# EAGLE design dig_ac230 (EAGLE 6.2)

## Sheet 1 of 4
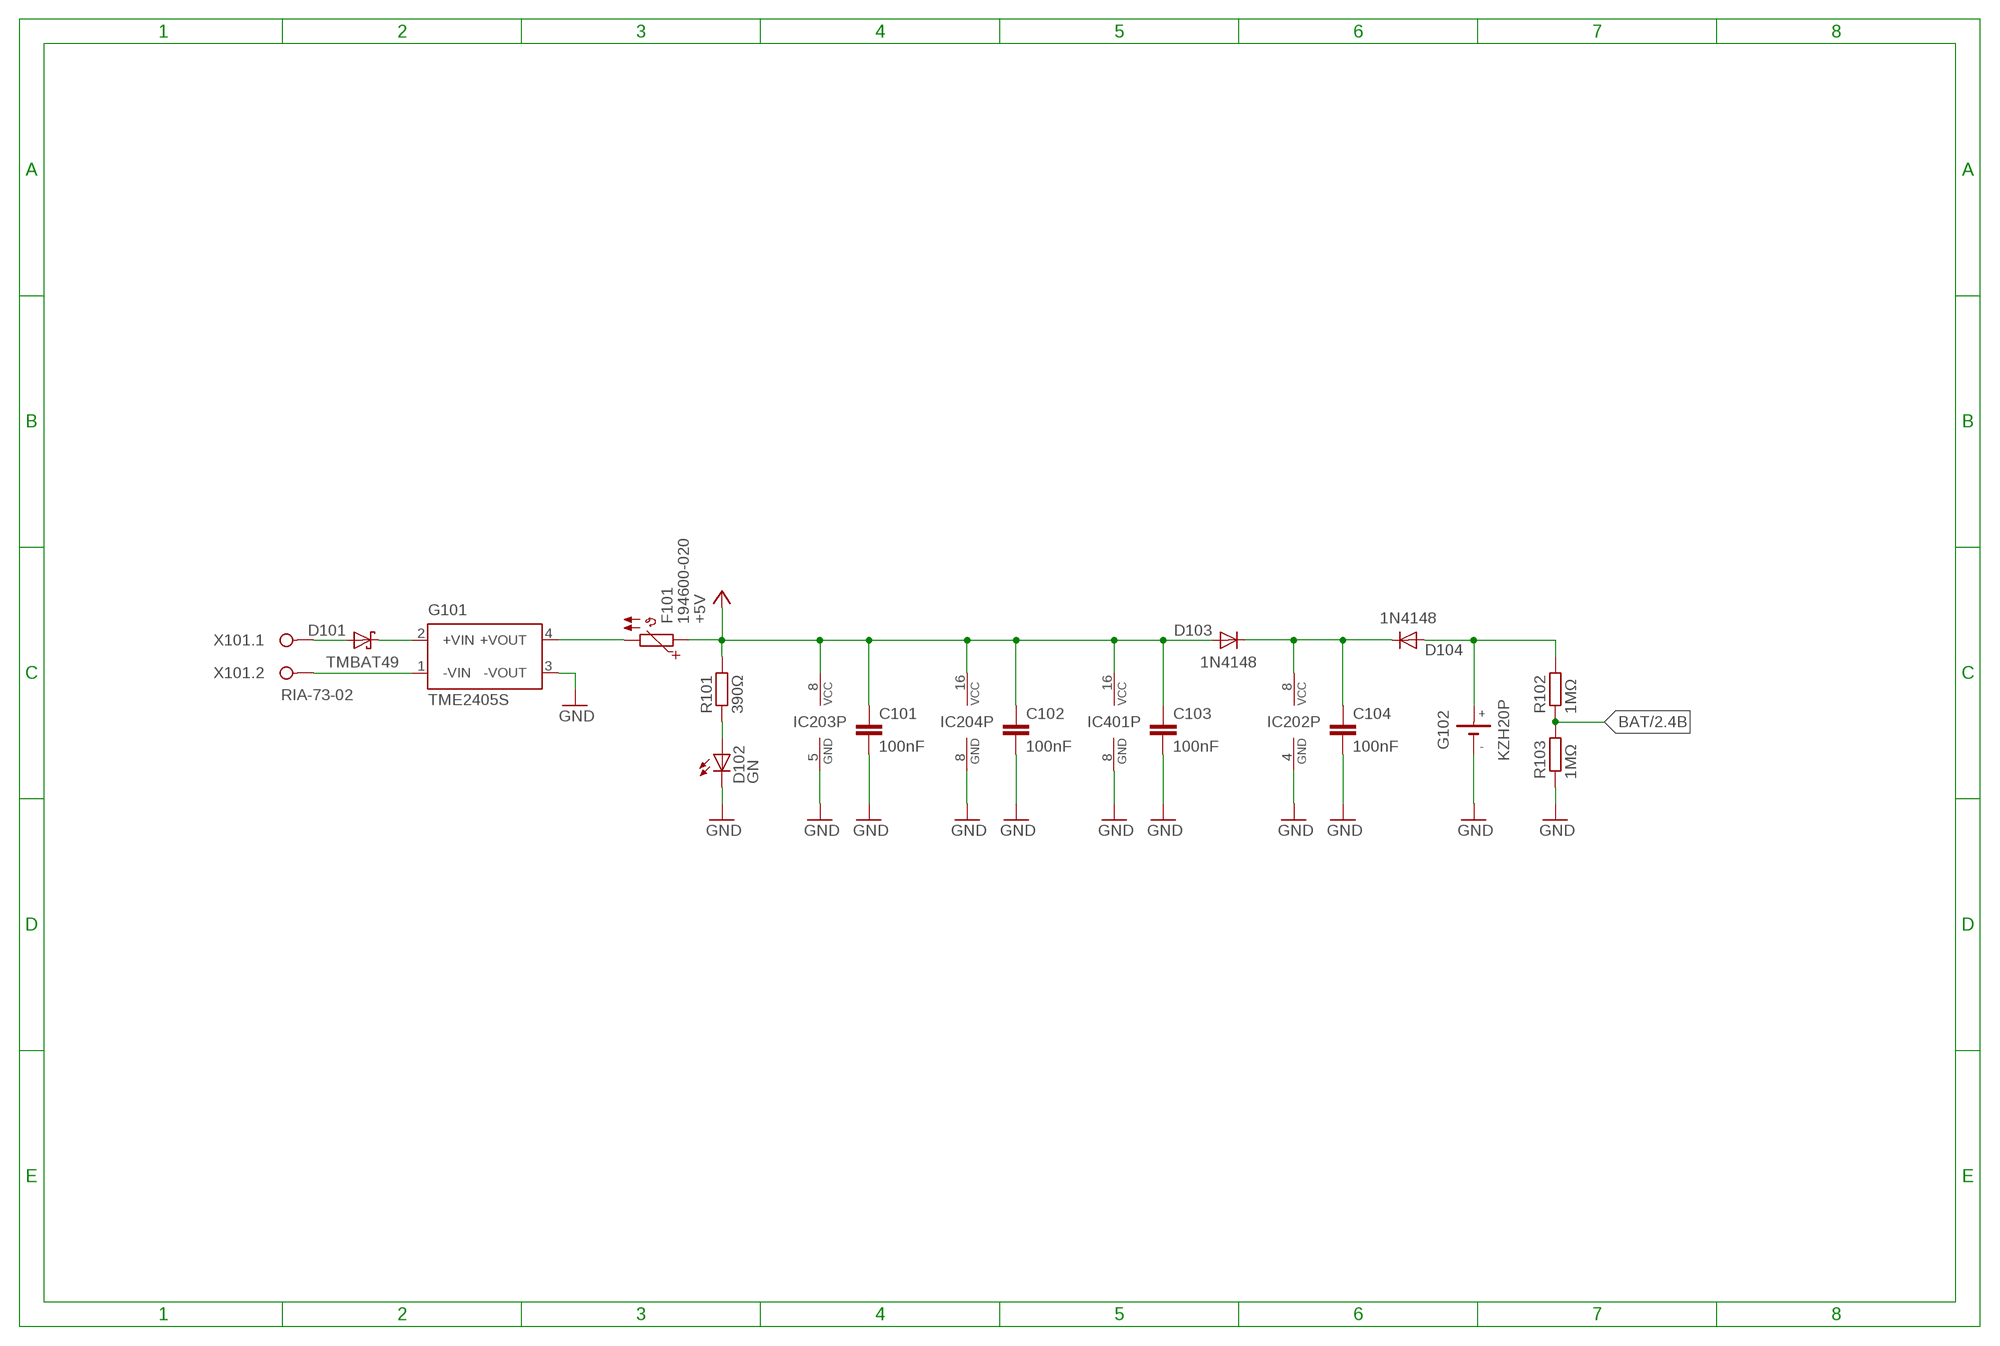
[diagram p0: schematic, sheet 1]

### Parts
C101  100nF  C_0805  [CHIP_0805]
C102  100nF  C_0805  [CHIP_0805]
C103  100nF  C_0805  [CHIP_0805]
C104  100nF  C_0805  [CHIP_0805]
D101  TMBAT49  SHOTKY-DIODE-MELF  [MELF]
D102  GN  LED3MM  [LED3MM]
D103  1N4148  DIODE-MINIMELF  [MINIMELF]
D104  1N4148  DIODE-MINIMELF  [MINIMELF]
F101  194600-020  [CHIP_1812]
G101  TME2405S  [TME-24V]
G102  KZH20P  [KZH20P]
IC202  DS1337S  [SOP08_127]
IC203  MAX487CSA  [SOP08_127]
IC204  74HC166D  [SOP16_127]
IC401  74HC595D  [SOP16_127]
R101  390Ω  R_0805  [CHIP_0805]
R102  1MΩ  R_0805  [CHIP_0805]
R103  1MΩ  R_0805  [CHIP_0805]
X101  RIA-73-02  [RIA-73-02]

### Nets
+5V: C101.1 C102.1 C103.1 D103.A F101.1 IC203.8(VCC) IC204.16(VCC) IC401.16(VCC) R101.2 ; also sheet 2,3
BAT: R102.1 R103.2 ; also sheet 2
GND: C101.2 C102.2 C103.2 C104.2 D102.K(C) G101.3(-VOUT) G102.N(-) IC202.4(GND) IC203.5(GND) IC204.8(GND) IC401.8(GND) R103.1 ; also sheet 2,3,4
N$19: G101.1(-VIN) X101.2
N$21: D104.A G102.P1(+) G102.P2(+) R102.2
N$23: D101.K G101.2(+VIN)
N$24: D101.A X101.1
N$41: F101.2 G101.4(+VOUT)
N$44: D102.A R101.1
N$64: C104.1 D103.K D104.K IC202.8(VCC)

## Sheet 2 of 4
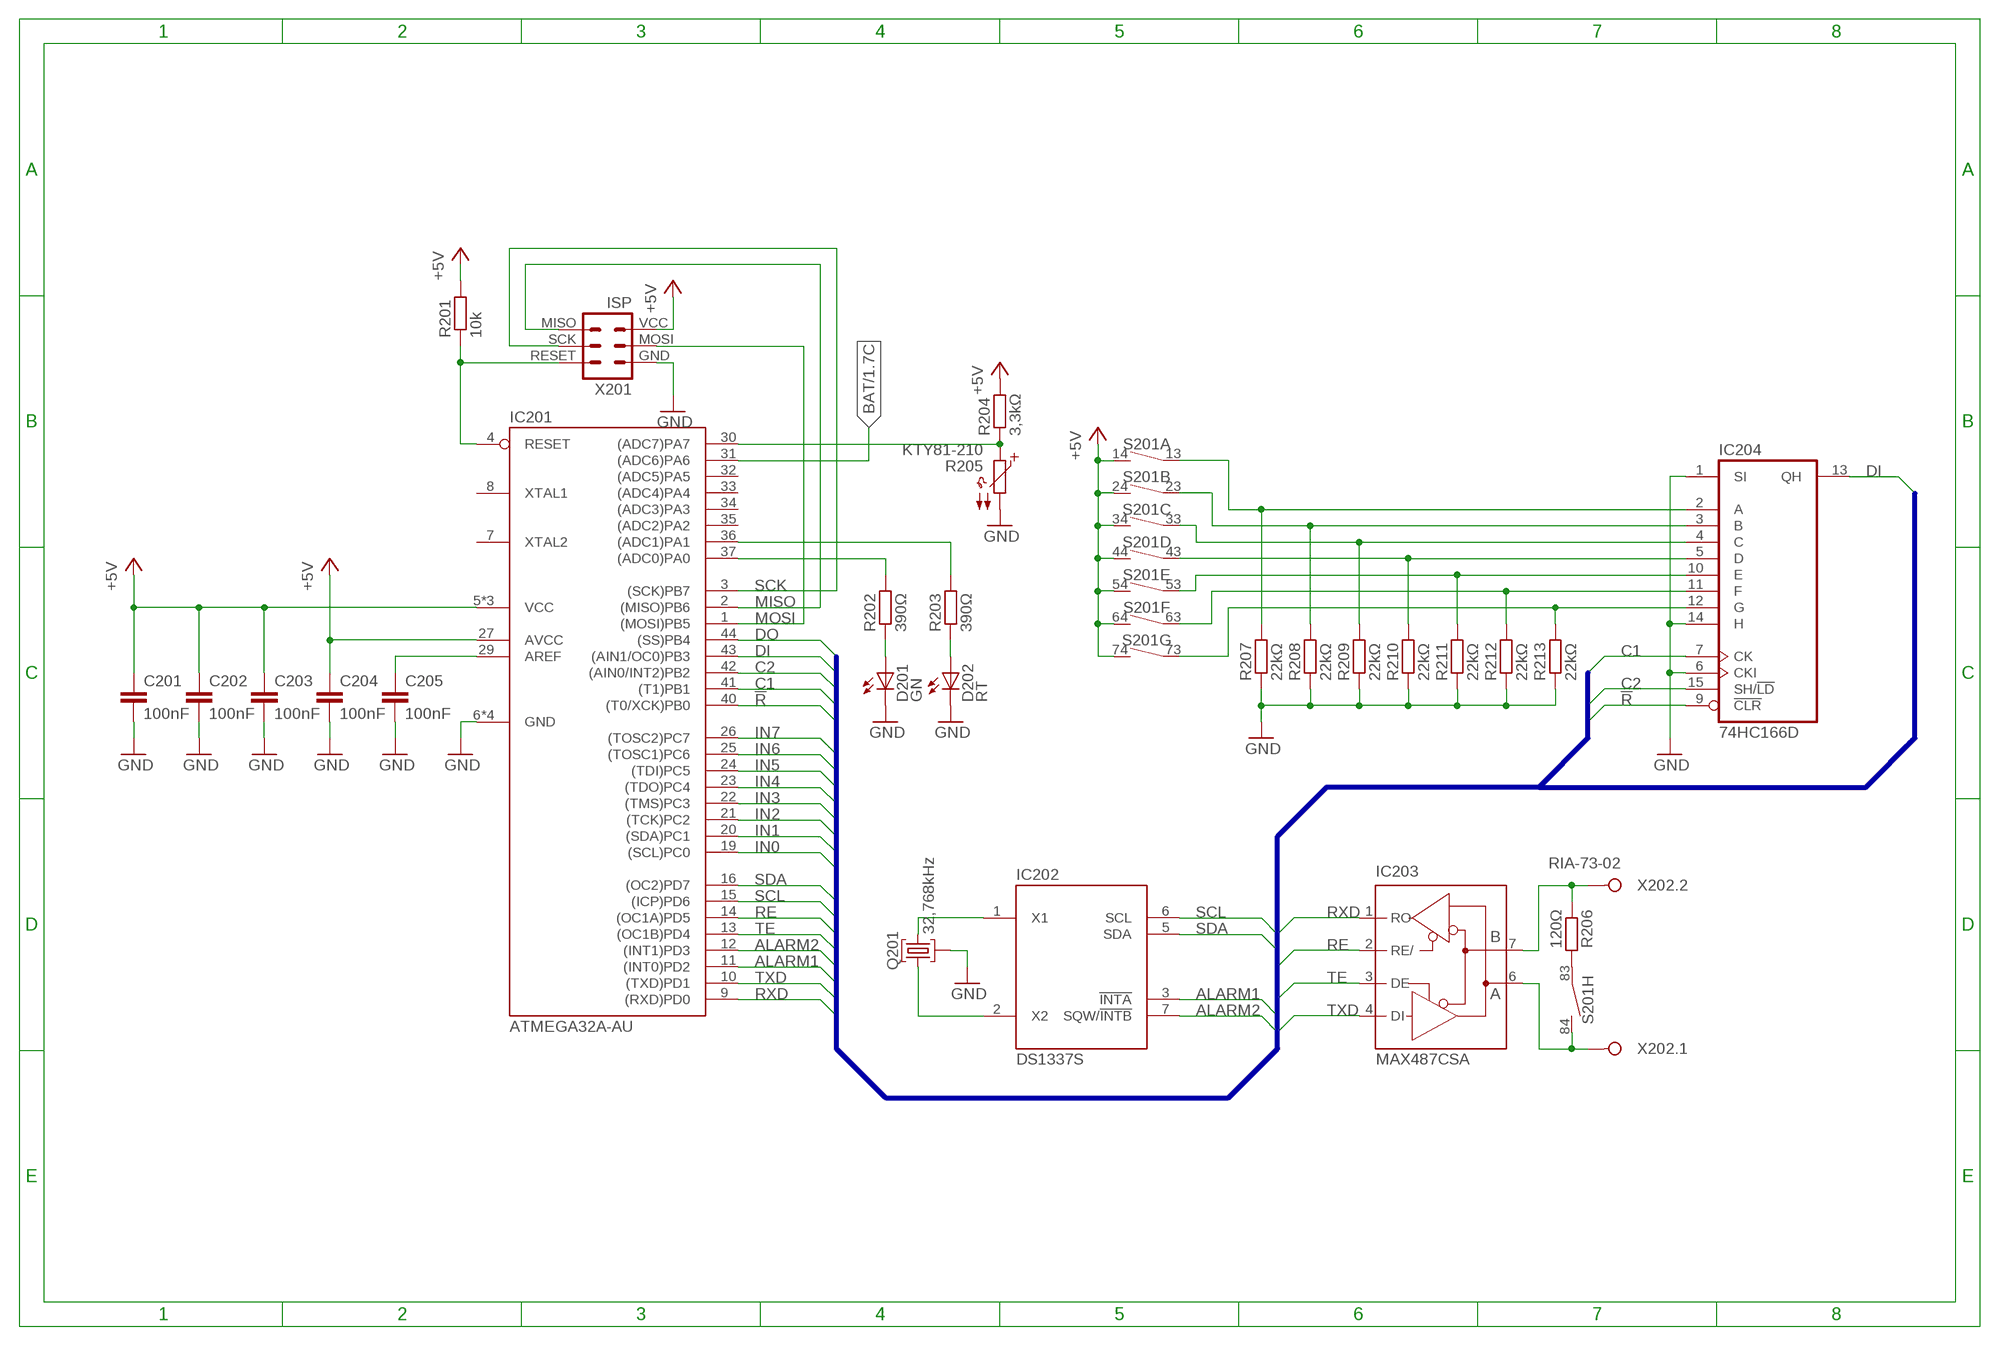
[diagram p1: schematic, sheet 2]

### Parts
C201  100nF  C_0805  [CHIP_0805]
C202  100nF  C_0805  [CHIP_0805]
C203  100nF  C_0805  [CHIP_0805]
C204  100nF  C_0805  [CHIP_0805]
C205  100nF  C_0805  [CHIP_0805]
D201  GN  LED3MM  [LED3MM]
D202  RT  LED3MM  [LED3MM]
IC201  ATMEGA32A-AU  [QFP44_08]
Q201  32,768kHz  QM_  [MS1V-T1K]
R201  10k  R_0805  [CHIP_0805]
R202  390Ω  R_0805  [CHIP_0805]
R203  390Ω  R_0805  [CHIP_0805]
R204  3,3kΩ  R_0805  [CHIP_0805]
R205  KTY81-210  [TO92]
R206  120Ω  R_0805  [CHIP_0805]
R207  22kΩ  R_0805  [CHIP_0805]
R208  22kΩ  R_0805  [CHIP_0805]
R209  22kΩ  R_0805  [CHIP_0805]
R210  22kΩ  R_0805  [CHIP_0805]
R211  22kΩ  R_0805  [CHIP_0805]
R212  22kΩ  R_0805  [CHIP_0805]
R213  22kΩ  R_0805  [CHIP_0805]
S201  DP08  [DP08]
X201  ISP  AVR_ISP6L  [ML6L]
X202  RIA-73-02  [RIA-73-02]

### Nets
!R: IC201.40((T0/XCK)PB0) IC204.9(!CLR) ; also sheet 4
+5V: C201.1 C202.1 C203.1 C204.1 IC201.5(VCC) IC201.17(VCC) IC201.27(AVCC) IC201.38(VCC) R201.2 R204.2 S201.14 S201.24 S201.34 S201.44 S201.54 S201.64 S201.74 X201.VCC ; also sheet 1,3
ALARM1: IC201.11((INT0)PD2) IC202.3(!INTA)
ALARM2: IC201.12((INT1)PD3) IC202.7(SQW/!INTB)
BAT: IC201.31((ADC6)PA6) ; also sheet 1
C1: IC201.41((T1)PB1) IC204.7(CK) ; also sheet 4
C2: IC201.42((AIN0/INT2)PB2) IC204.15(SH/!LD) ; also sheet 4
DI: IC201.43((AIN1/OC0)PB3) IC204.13(QH)
DO: IC201.44((SS)PB4) ; also sheet 4
GND: C201.2 C202.2 C203.2 C204.2 C205.2 D201.K(C) D202.K(C) IC201.6(GND) IC201.18(GND) IC201.28(GND) IC201.39(GND) IC204.1(SI) IC204.6(CKI) IC204.14(H) Q201.G R205.2 R207.1 R208.1 R209.1 R210.1 R211.1 R212.1 R213.1 X201.GND ; also sheet 1,3,4
IN0: IC201.19((SCL)PC0) ; also sheet 3
IN1: IC201.20((SDA)PC1) ; also sheet 3
IN2: IC201.21((TCK)PC2) ; also sheet 3
IN3: IC201.22((TMS)PC3) ; also sheet 3
IN4: IC201.23((TDO)PC4) ; also sheet 3
IN5: IC201.24((TDI)PC5) ; also sheet 3
IN6: IC201.25((TOSC1)PC6) ; also sheet 3
IN7: IC201.26((TOSC2)PC7) ; also sheet 3
MISO: IC201.2((MISO)PB6) X201.MISO
MOSI: IC201.1((MOSI)PB5) X201.MOSI
N$20: IC203.6(A) S201.84 X202.1
N$22: IC203.7(B) R206.1 X202.2
N$25: C205.1 IC201.29(AREF)
N$26: IC204.2(A) R207.2 S201.13
N$27: IC204.3(B) R208.2 S201.23
N$28: IC204.4(C) R209.2 S201.33
N$29: IC204.5(D) R210.2 S201.43
N$30: IC204.10(E) R211.2 S201.53
N$31: IC204.11(F) R212.2 S201.63
N$32: IC204.12(G) R213.2 S201.73
N$33: R206.2 S201.83
N$42: IC201.4(RESET) R201.1 X201.RESET
N$61: IC201.30((ADC7)PA7) R204.1 R205.1
N$62: D201.A R202.1
N$63: D202.A R203.1
N$90: IC201.37((ADC0)PA0) R202.2
N$92: IC201.36((ADC1)PA1) R203.2
N$126: IC202.1(X1) Q201.2
N$127: IC202.2(X2) Q201.1
RE: IC201.14((OC1A)PD5) IC203.2(RE/)
RXD: IC201.9((RXD)PD0) IC203.1(RO)
SCK: IC201.3((SCK)PB7) X201.SCK
SCL: IC201.15((ICP)PD6) IC202.6(SCL)
SDA: IC201.16((OC2)PD7) IC202.5(SDA)
TE: IC201.13((OC1B)PD4) IC203.3(DE)
TXD: IC201.10((TXD)PD1) IC203.4(DI)
Unconnected: IC201.7(XTAL2) IC201.8(XTAL1) IC201.32((ADC5)PA5) IC201.33((ADC4)PA4) IC201.34((ADC3)PA3) IC201.35((ADC2)PA2)

### Buses
IN[0..7],C1,C2,DO,DI,!R,RXD,TXD,RE,TE,SCL,SDA,ALARM1,ALARM2

## Sheet 3 of 4
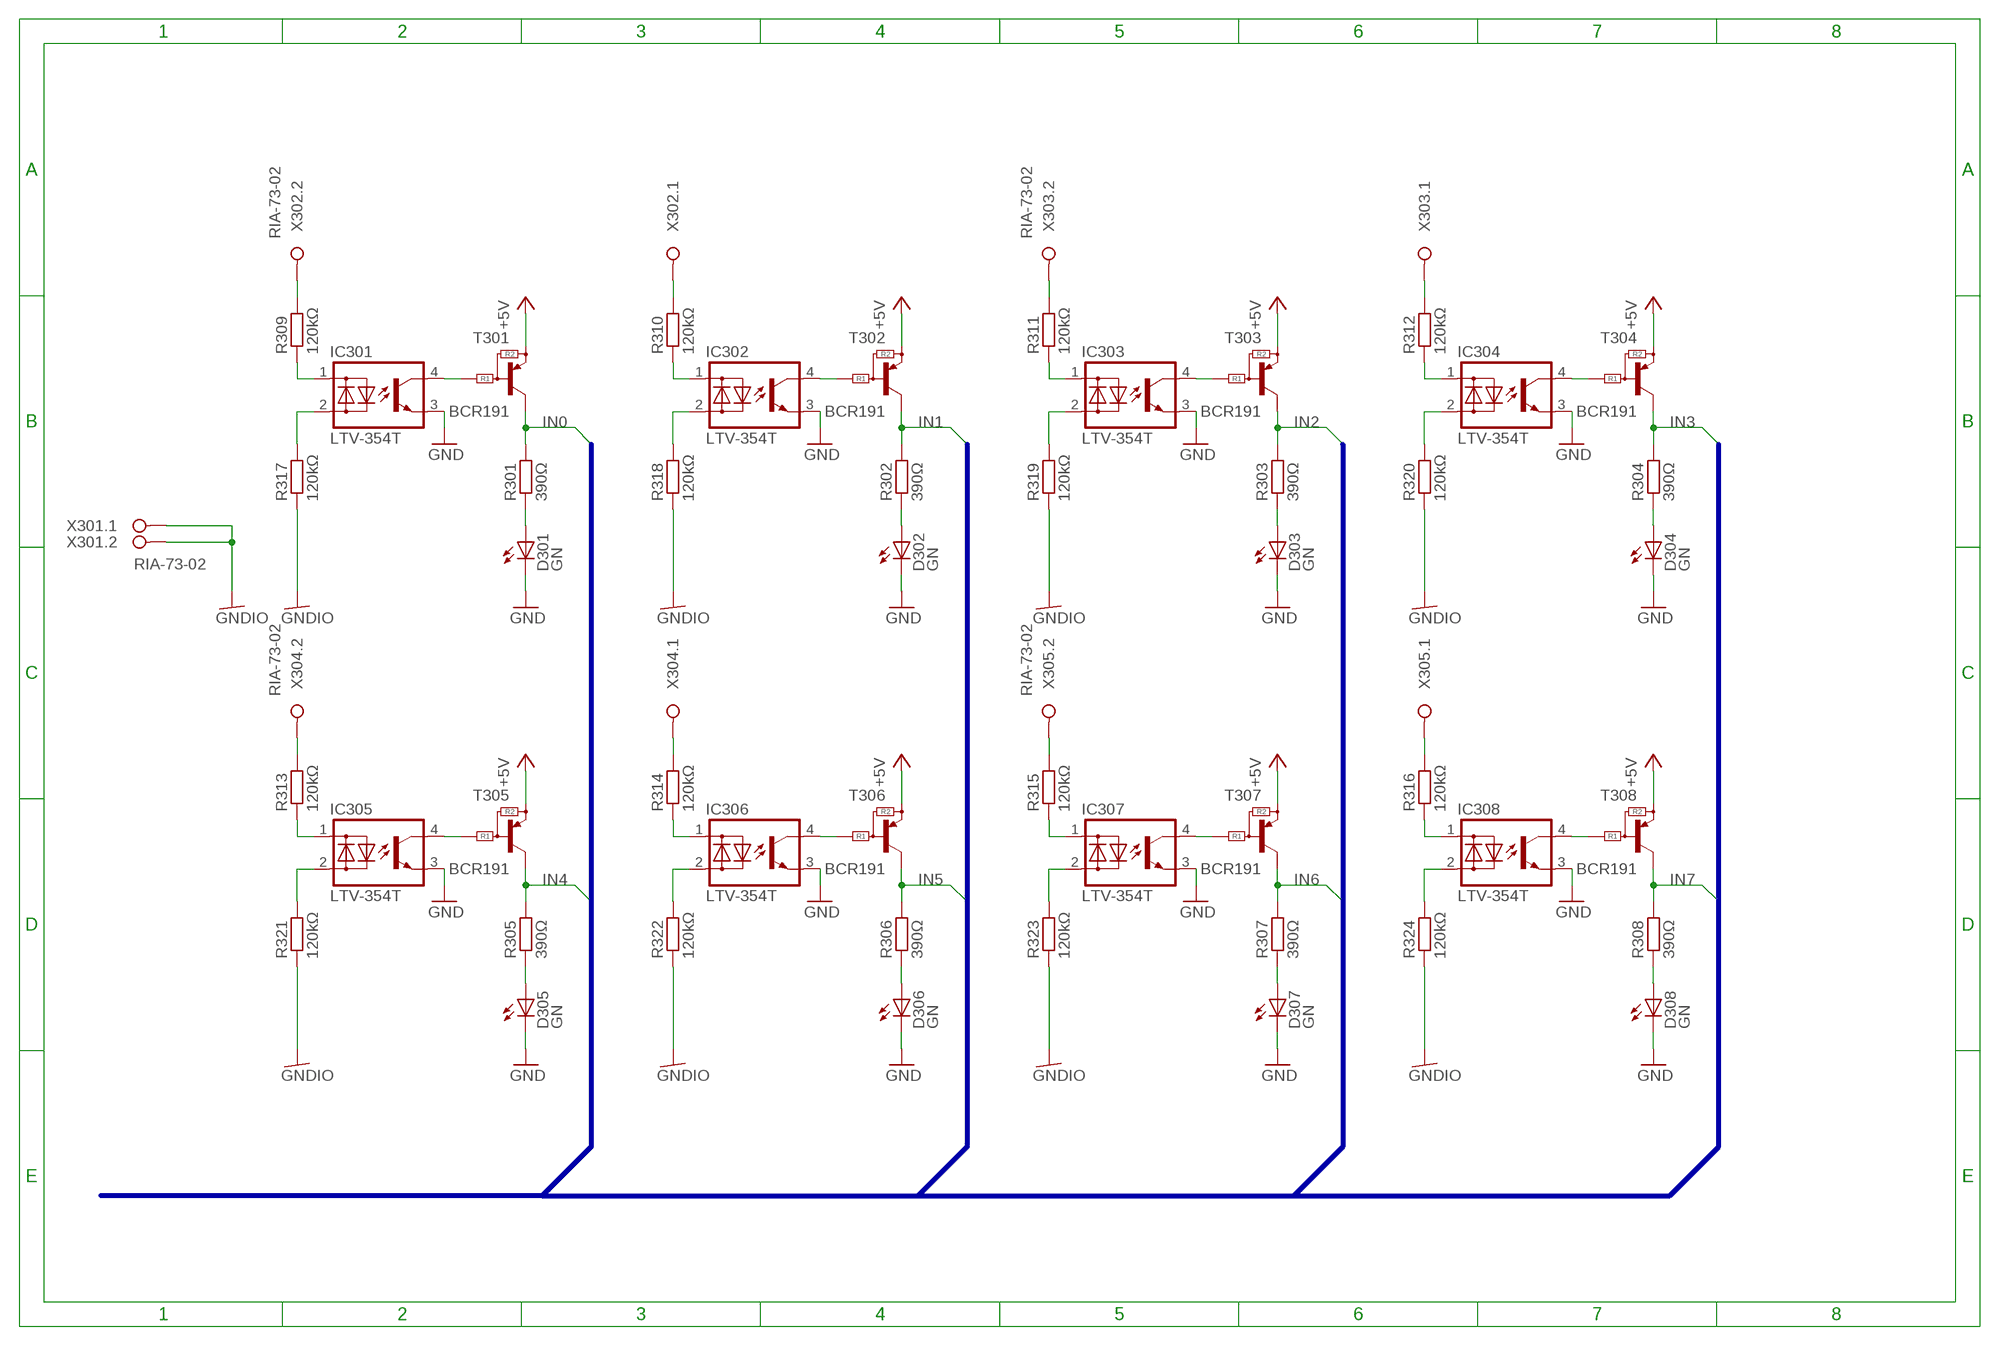
[diagram p2: schematic, sheet 3]

### Parts
D301  GN  LED3MM  [LED3MM]
D302  GN  LED3MM  [LED3MM]
D303  GN  LED3MM  [LED3MM]
D304  GN  LED3MM  [LED3MM]
D305  GN  LED3MM  [LED3MM]
D306  GN  LED3MM  [LED3MM]
D307  GN  LED3MM  [LED3MM]
D308  GN  LED3MM  [LED3MM]
IC301  LTV-354T  [SOP04_254]
IC302  LTV-354T  [SOP04_254]
IC303  LTV-354T  [SOP04_254]
IC304  LTV-354T  [SOP04_254]
IC305  LTV-354T  [SOP04_254]
IC306  LTV-354T  [SOP04_254]
IC307  LTV-354T  [SOP04_254]
IC308  LTV-354T  [SOP04_254]
R301  390Ω  R_0805  [CHIP_0805]
R302  390Ω  R_0805  [CHIP_0805]
R303  390Ω  R_0805  [CHIP_0805]
R304  390Ω  R_0805  [CHIP_0805]
R305  390Ω  R_0805  [CHIP_0805]
R306  390Ω  R_0805  [CHIP_0805]
R307  390Ω  R_0805  [CHIP_0805]
R308  390Ω  R_0805  [CHIP_0805]
R309  120kΩ  R_1206  [CHIP_1206]
R310  120kΩ  R_1206  [CHIP_1206]
R311  120kΩ  R_1206  [CHIP_1206]
R312  120kΩ  R_1206  [CHIP_1206]
R313  120kΩ  R_1206  [CHIP_1206]
R314  120kΩ  R_1206  [CHIP_1206]
R315  120kΩ  R_1206  [CHIP_1206]
R316  120kΩ  R_1206  [CHIP_1206]
R317  120kΩ  R_1206  [CHIP_1206]
R318  120kΩ  R_1206  [CHIP_1206]
R319  120kΩ  R_1206  [CHIP_1206]
R320  120kΩ  R_1206  [CHIP_1206]
R321  120kΩ  R_1206  [CHIP_1206]
R322  120kΩ  R_1206  [CHIP_1206]
R323  120kΩ  R_1206  [CHIP_1206]
R324  120kΩ  R_1206  [CHIP_1206]
T301  BCR191  PNP2R-SOT23-BEC  [SOT23]
T302  BCR191  PNP2R-SOT23-BEC  [SOT23]
T303  BCR191  PNP2R-SOT23-BEC  [SOT23]
T304  BCR191  PNP2R-SOT23-BEC  [SOT23]
T305  BCR191  PNP2R-SOT23-BEC  [SOT23]
T306  BCR191  PNP2R-SOT23-BEC  [SOT23]
T307  BCR191  PNP2R-SOT23-BEC  [SOT23]
T308  BCR191  PNP2R-SOT23-BEC  [SOT23]
X301  RIA-73-02  [RIA-73-02]
X302  RIA-73-02  [RIA-73-02]
X303  RIA-73-02  [RIA-73-02]
X304  RIA-73-02  [RIA-73-02]
X305  RIA-73-02  [RIA-73-02]

### Nets
+5V: T301.2(E) T302.2(E) T303.2(E) T304.2(E) T305.2(E) T306.2(E) T307.2(E) T308.2(E) ; also sheet 1,2
GND: D301.K(C) D302.K(C) D303.K(C) D304.K(C) D305.K(C) D306.K(C) D307.K(C) D308.K(C) IC301.3(E) IC302.3(E) IC303.3(E) IC304.3(E) IC305.3(E) IC306.3(E) IC307.3(E) IC308.3(E) ; also sheet 1,2,4
GNDIO [netz]: R317.1 R318.1 R319.1 R320.1 R321.1 R322.1 R323.1 R324.1 X301.1 X301.2
IN0: R301.2 T301.3(C) ; also sheet 2
IN1: R302.2 T302.3(C) ; also sheet 2
IN2: R303.2 T303.3(C) ; also sheet 2
IN3: R304.2 T304.3(C) ; also sheet 2
IN4: R305.2 T305.3(C) ; also sheet 2
IN5: R306.2 T306.3(C) ; also sheet 2
IN6: R307.2 T307.3(C) ; also sheet 2
IN7: R308.2 T308.3(C) ; also sheet 2
N$1 [netz]: R309.2 X302.2
N$2 [netz]: IC301.1(A) R309.1
N$3 [netz]: IC301.2(K) R317.2
N$4 [netz]: R310.2 X302.1
N$5 [netz]: IC302.1(A) R310.1
N$6 [netz]: IC302.2(K) R318.2
N$7 [netz]: R311.2 X303.2
N$8 [netz]: IC303.1(A) R311.1
N$9 [netz]: IC303.2(K) R319.2
N$10 [netz]: R312.2 X303.1
N$11 [netz]: IC304.1(A) R312.1
N$12 [netz]: IC304.2(K) R320.2
N$13 [netz]: R313.2 X304.2
N$14 [netz]: IC305.1(A) R313.1
N$15 [netz]: IC305.2(K) R321.2
N$16 [netz]: R314.2 X304.1
N$34: D304.A R304.1
N$35 [netz]: IC306.1(A) R314.1
N$36: D303.A R303.1
N$37 [netz]: IC306.2(K) R322.2
N$38: D302.A R302.1
N$39 [netz]: IC307.1(A) R315.1
N$40: D301.A R301.1
N$50 [netz]: IC307.2(K) R323.2
N$52: IC304.4(C) T304.1(B)
N$55: D305.A R305.1
N$57 [netz]: R315.2 X305.2
N$65: D306.A R306.1
N$67 [netz]: R316.2 X305.1
N$69: D307.A R307.1
N$70: IC303.4(C) T303.1(B)
N$71 [netz]: IC308.1(A) R316.1
N$73: IC302.4(C) T302.1(B)
N$75: IC301.4(C) T301.1(B)
N$77: D308.A R308.1
N$79 [netz]: IC308.2(K) R324.2
N$80: IC305.4(C) T305.1(B)
N$81: IC306.4(C) T306.1(B)
N$83: IC307.4(C) T307.1(B)
N$85: IC308.4(C) T308.1(B)

### Buses
IN[0..7],C1,C2,DO,DI,!R,RXD,TXD,RE,TE,SCL,SDA,ALARM1,ALARM2

## Sheet 4 of 4
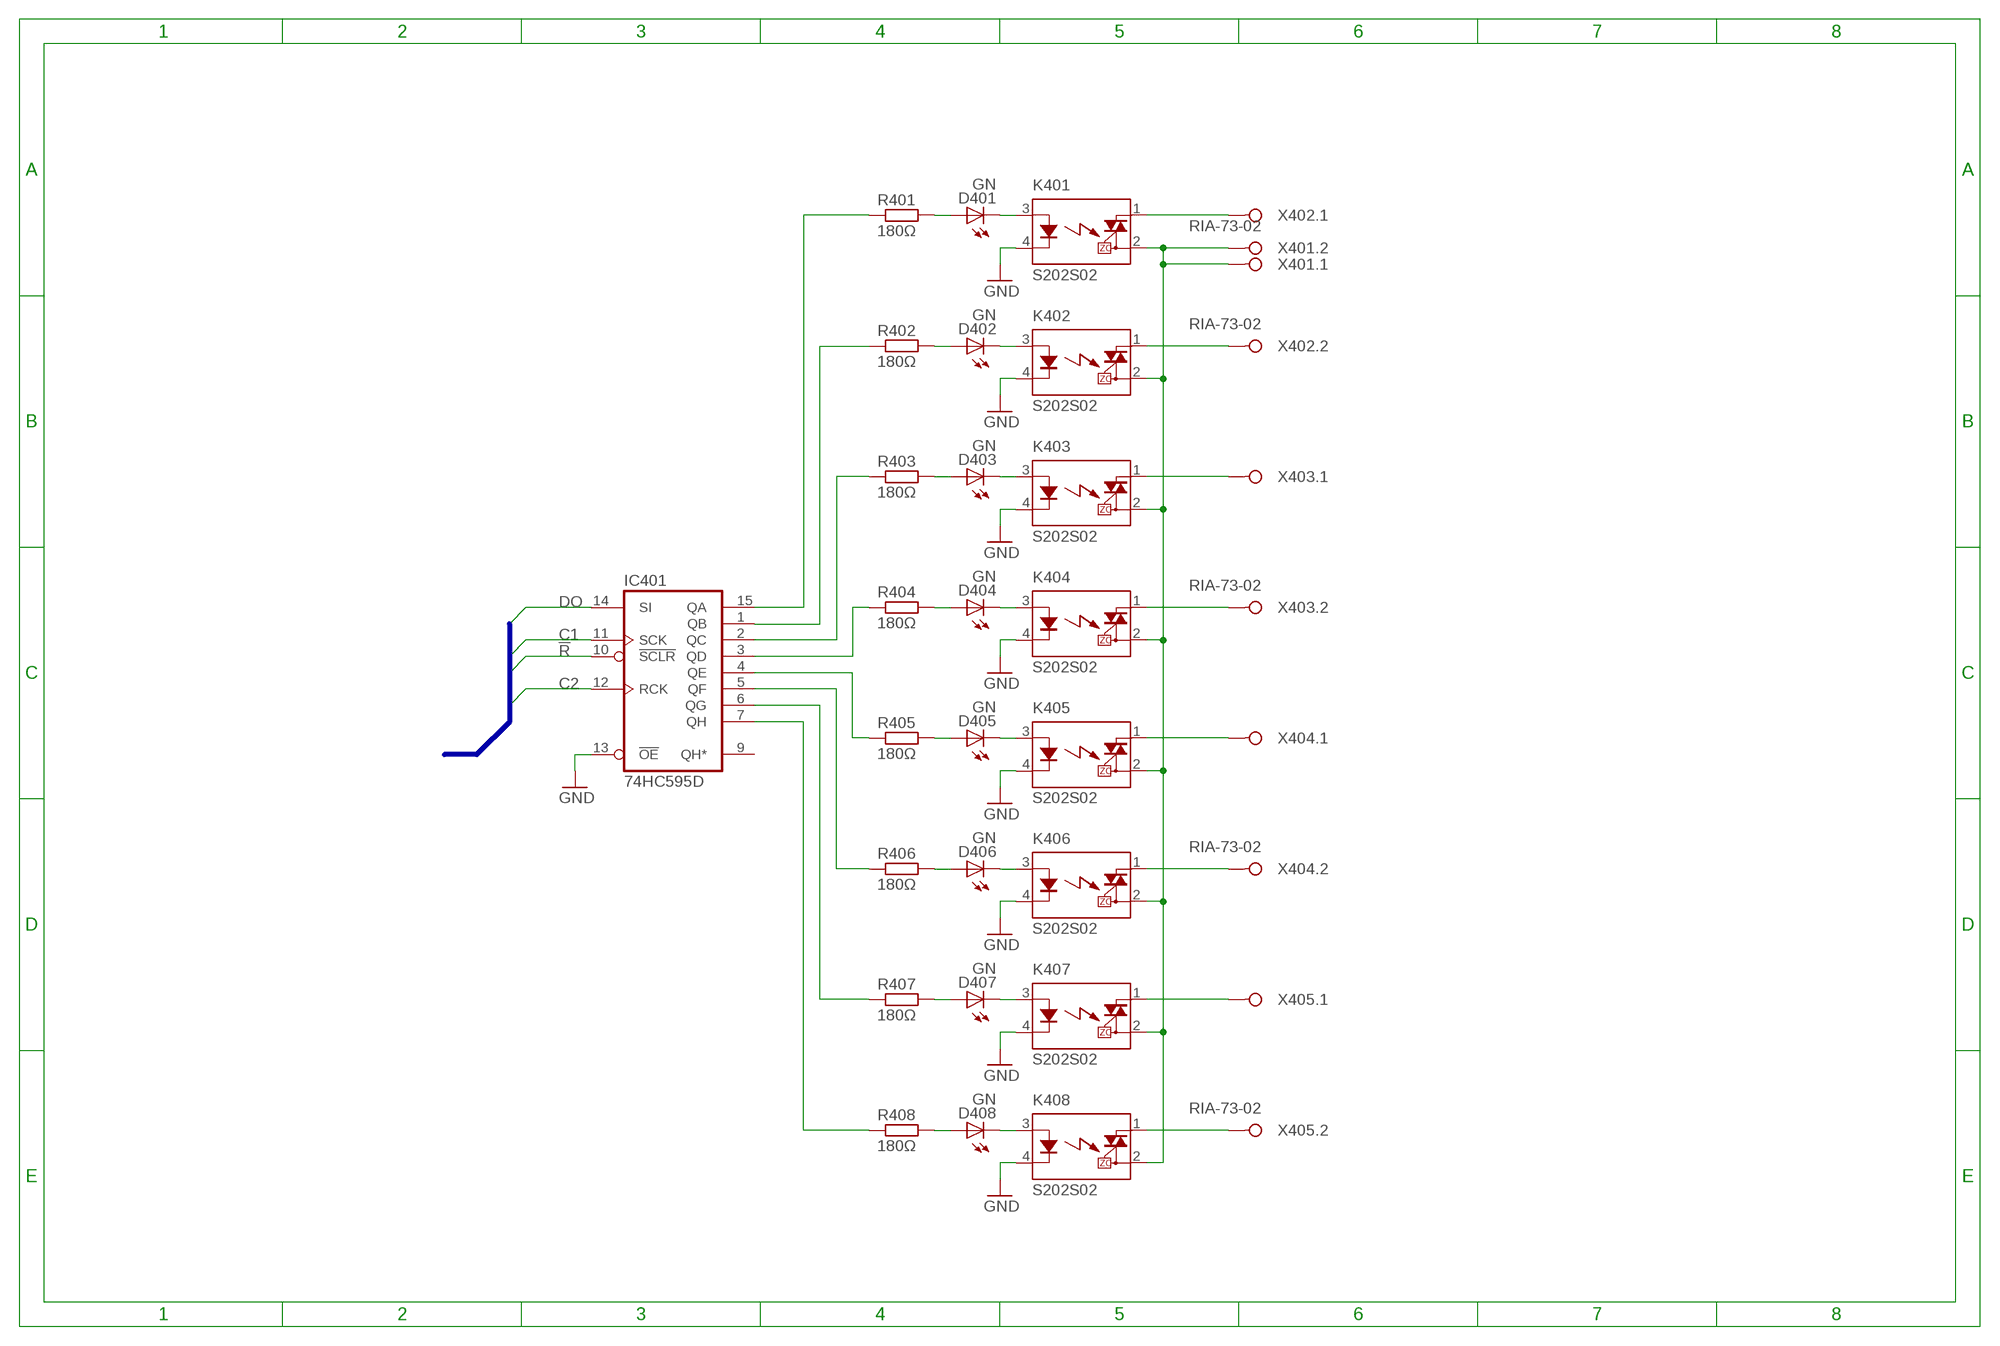
[diagram p3: schematic, sheet 4]

### Parts
D401  GN  LED3MM  [LED3MM]
D402  GN  LED3MM  [LED3MM]
D403  GN  LED3MM  [LED3MM]
D404  GN  LED3MM  [LED3MM]
D405  GN  LED3MM  [LED3MM]
D406  GN  LED3MM  [LED3MM]
D407  GN  LED3MM  [LED3MM]
D408  GN  LED3MM  [LED3MM]
K401  S202S02  [SIP4]
K402  S202S02  [SIP4]
K403  S202S02  [SIP4]
K404  S202S02  [SIP4]
K405  S202S02  [SIP4]
K406  S202S02  [SIP4]
K407  S202S02  [SIP4]
K408  S202S02  [SIP4]
R401  180Ω  R_0805  [CHIP_0805]
R402  180Ω  R_0805  [CHIP_0805]
R403  180Ω  R_0805  [CHIP_0805]
R404  180Ω  R_0805  [CHIP_0805]
R405  180Ω  R_0805  [CHIP_0805]
R406  180Ω  R_0805  [CHIP_0805]
R407  180Ω  R_0805  [CHIP_0805]
R408  180Ω  R_0805  [CHIP_0805]
X401  RIA-73-02  [RIA-73-02]
X402  RIA-73-02  [RIA-73-02]
X403  RIA-73-02  [RIA-73-02]
X404  RIA-73-02  [RIA-73-02]
X405  RIA-73-02  [RIA-73-02]

### Nets
!R: IC401.10(!SCLR) ; also sheet 2
C1: IC401.11(SCK) ; also sheet 2
C2: IC401.12(RCK) ; also sheet 2
DO: IC401.14(SI) ; also sheet 2
GND: IC401.13(!OE) K401.4(K) K402.4(K) K403.4(K) K404.4(K) K405.4(K) K406.4(K) K407.4(K) K408.4(K) ; also sheet 1,2,3
L [netz]: K401.2(DS2) K402.2(DS2) K403.2(DS2) K404.2(DS2) K405.2(DS2) K406.2(DS2) K407.2(DS2) K408.2(DS2) X401.1 X401.2
N$17: D401.K(C) K401.3(A)
N$18: D402.K(C) K402.3(A)
N$43: D403.K(C) K403.3(A)
N$45: D404.K(C) K404.3(A)
N$46: D405.K(C) K405.3(A)
N$47: D406.K(C) K406.3(A)
N$48: D407.K(C) K407.3(A)
N$49: D408.K(C) K408.3(A)
N$51: IC401.15(QA) R401.1
N$53: IC401.1(QB) R402.1
N$54: IC401.2(QC) R403.1
N$56: IC401.3(QD) R404.1
N$58: IC401.4(QE) R405.1
N$59: IC401.5(QF) R406.1
N$60: IC401.6(QG) R407.1
N$66: IC401.7(QH) R408.1
N$68 [netz]: K401.1(DS1) X402.1
N$72 [netz]: K402.1(DS1) X402.2
N$74 [netz]: K403.1(DS1) X403.1
N$76 [netz]: K404.1(DS1) X403.2
N$78 [netz]: K405.1(DS1) X404.1
N$82 [netz]: K406.1(DS1) X404.2
N$84 [netz]: K407.1(DS1) X405.1
N$89 [netz]: K408.1(DS1) X405.2
N$103: D401.A R401.2
N$104: D402.A R402.2
N$105: D403.A R403.2
N$106: D404.A R404.2
N$107: D405.A R405.2
N$108: D406.A R406.2
N$109: D407.A R407.2
N$110: D408.A R408.2
Unconnected: IC401.9(QH*)

### Buses
IN[0..7],C1,C2,DO,DI,!R,RXD,TXD,RE,TE,SCL,SDA,ALARM1,ALARM2

## Library data of the parts
C101-C104 C201-C205 = passiv:C_: CAPACITOR, European symbol
D101 = diode:SHOTKY-DIODE
D102 D201 D202 D301-D308 D401-D408 = led:LED: LED
D103 D104 = diode:DIODE
F101 = sicherung:194600-*: Selbstrückstellende Sicherung / PTC-Fuse Datasheet: 194600.pdf <./eagle/doc/sicherung/194600.pdf>
G101 = schaltregler:TME?*: DC/DC Converter TME Series 1 Watt traco_tme.pdf <./eagle/doc/schaltregler/traco_tme.pdf>; MPN: TME 2405S; OC_FARNELL: 1007547; OC_NEWARK: 51R5329
G102 = batterie:KZH20: Knopfzellenhalter
IC201 = ic-mcu:ATMEGA32A: Microcontroller Typ Flash SRAM EEPROM GPIO ADC DAC PWM Timer Ports ATmega32A <./eagle/doc/ic-mcu/atmega32a.pdf> 32kB 2kB 1kB 32 8x 10bit 2x 8bit, 2x 16bit 2x 8bit, 1x 16bit JTAG, USART, I2C, SPI
IC202 = ic-controller:DS1337: Echtzeituhr Datasheet: ds1337.pdf <./eagle/doc/ic-controller/ds1337.pdf>
IC203 = ic-wandler:MAX48*: RS485 TRANSEIVER Datasheet: max1487-max491.pdf <./eagle/doc/ic-wandler/max1487-max491.pdf> Part Number Half- / Fullduplex Datarate (Mbps) Slew-Rate limited Low-Power shutdown Receiver / Driver enable Quiescent current (μA) Number of Receivers un bus MAX481 Half 2.5 No Yes Yes 300 32 MAX483 Half 0.25 Yes Yes Yes 120 32 MAX485 Half 2.5 No No Yes 300 32 MAX487 Half 0.25 Yes Yes Yes 120 128
IC204 = ic-logik:74*166: 8Bit Schiberegister PISO Datasheet: m74hc166.pdf <./eagle/doc/ic-logik/m74hc166.pdf> Pin Bedeutung Beschreibung SI Shift input Serieller Daten eingang CK Cock Daten weiterschieben bei positiver Flanke CKI Cock inhibit Clock bei L freischalten SH/LD Shift / Load L läd bei Clock die Daten CLR Clear Schieberegister wird bei L gelöscht
IC301-IC308 = ic-optokoppler:LTV-354T: Liteon Optokoppler ltv-354t.pdf <./eagle/doc/ic-optokoppler/ltv-354t.pdf>
IC401 = ic-logik:74*595: 8Bit Schiberegister SIPO Datasheet: m74hc595.pdf <./eagle/doc/ic-logik/m74hc595.pdf> Pin Bedeutung Beschreibung SI Shift input Serieller Daten eingang SCK Shift cock Daten weiterschieben bei positiver Flanke SCLR Shift clear Schieberegister wird bei L gelöscht RCK Register cock Daten vom Schieberegister werden bei positiver Flanke in den Latch übertragen OE Output enable Ausgänge bei L aktiv
K401-K408 = relais:S*02S02: IT(rms) 8A, Zero Cross type SIP 4pin Triac output SSR s102s02.pdf <./eagle/doc/relais/s102s02.pdf>; VDRM: 600
Q201 = passiv:QM_: SMD Quarz Datasheet: ms1v-t1k.pdf <./eagle/doc/passiv/ms1v-t1k.pdf>
R101-R103 R201-R204 R206-R213 R301-R324 R401-R408 = passiv:R_: RESISTOR, European symbol
R205 = sensor:KTY81: Silikon Temperatursensor Datasheet: kty81-1.pdf <./eagle/doc/sensor/kty81-1.pdf> / kty81-2.pdf <./eagle/doc/sensor/kty81-2.pdf>
S201 = schalter:DP08: Piano-Dip-Schalter Datasheet: dp.pdf <./eagle/doc/schalter/dp.pdf>
T301-T308 = transistor:PNP2R: PNP Digitaltransistor Typ Variant VCEO (V) IC (mA) PD (mW) R1 (kOhm) R2 (kOhm) Source BCR191 SOT23-BEC -50 -100 200 22 22 bcr191.pdf <./eagle/doc/transistor/bcr191.pdf>
X101 X202 X301-X305 X401-X405 = anschluss:RIA-73-02
X201 = stecker:AVR_ISP6: HARTING

## Net classes
1 netz: clearance 3 mm to class 0, clearance 1 mm

## Board
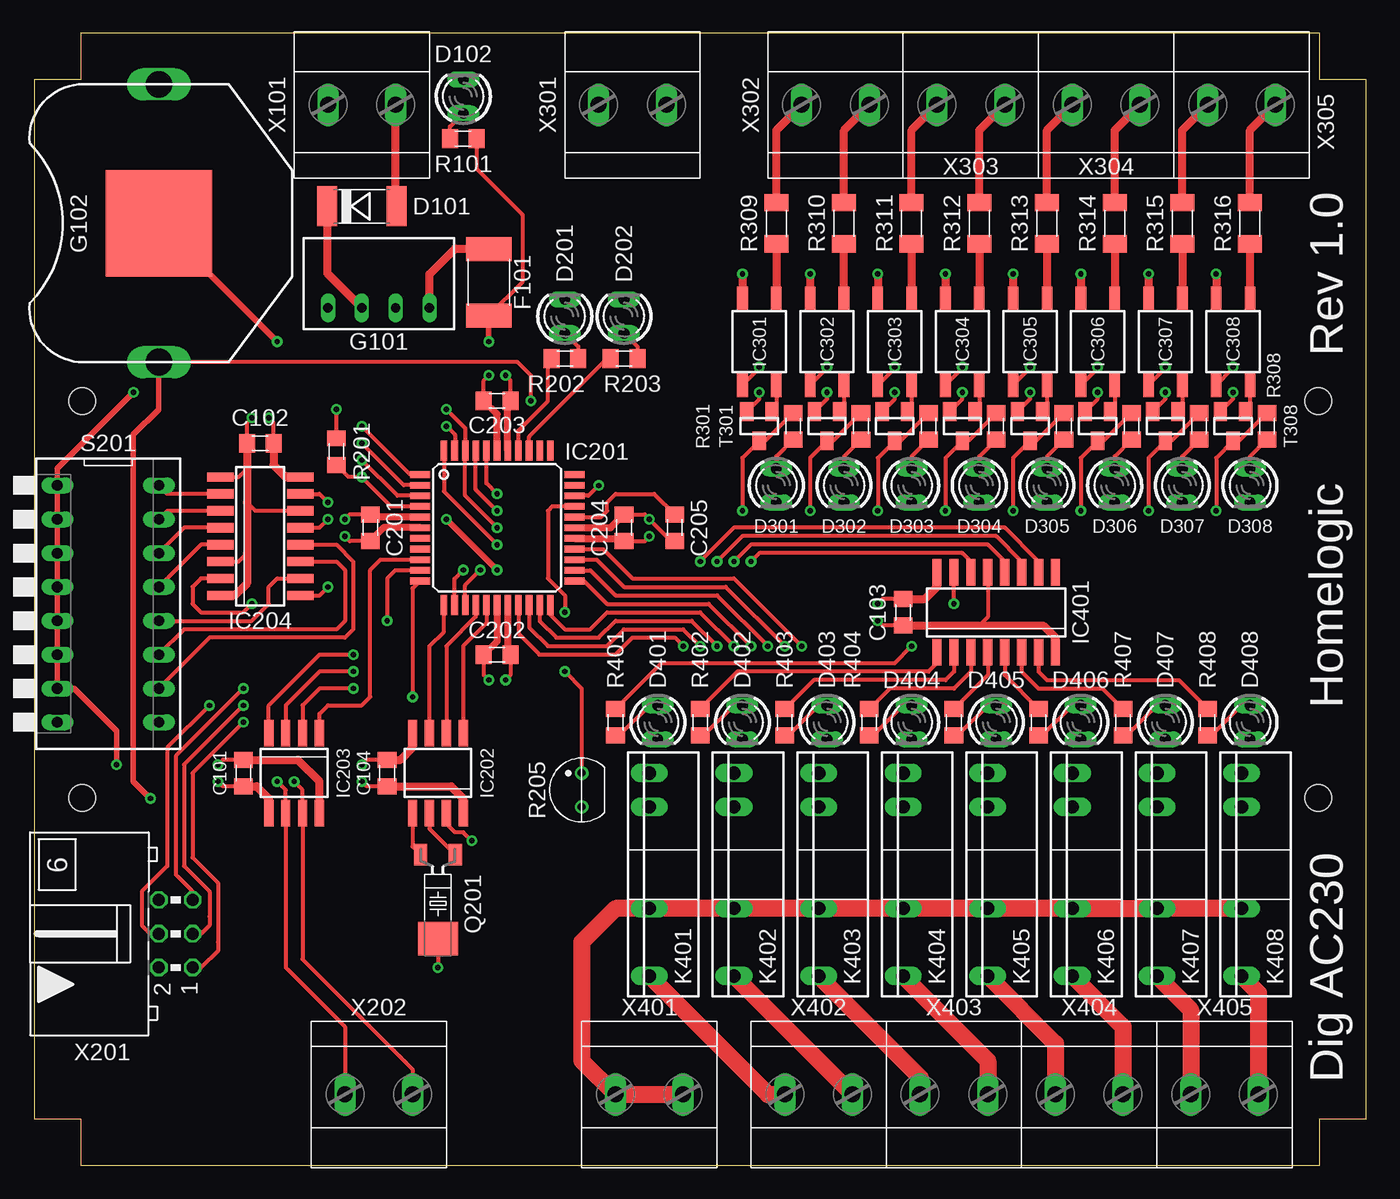
[diagram p4: board, top side]
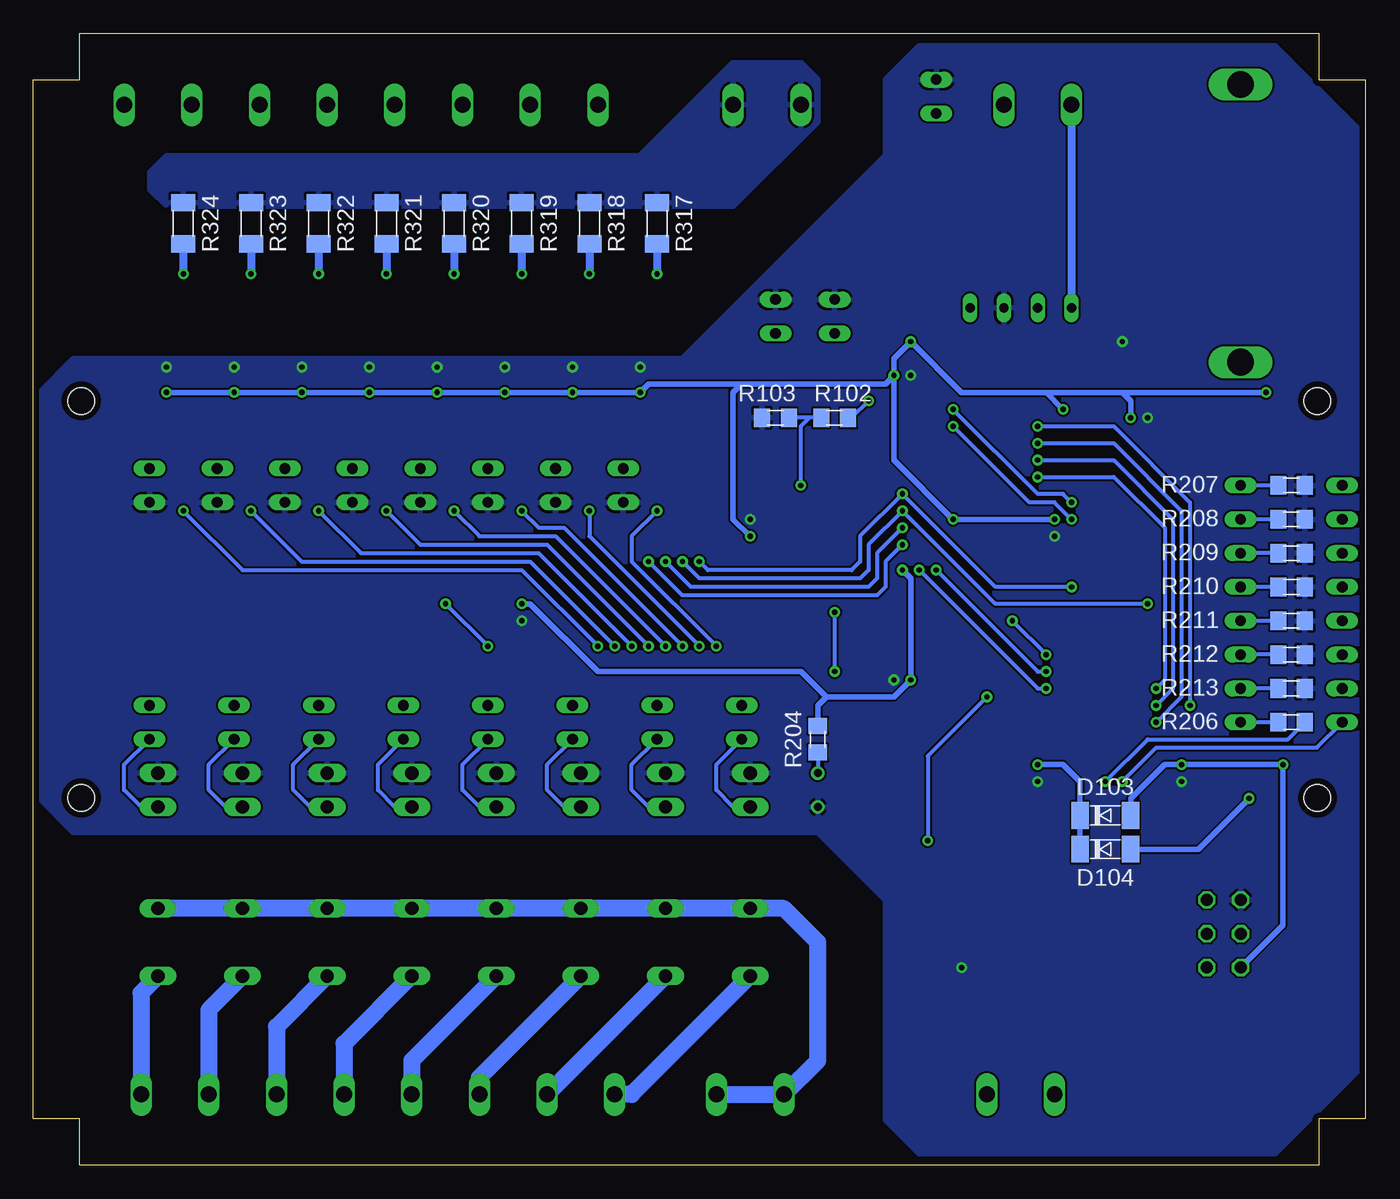
[diagram p5: board, bottom side, seen from below]

Size 100 x 85 mm. Coordinates in mm from the lower left corner, seen from the top.
Outline: 0,81.5 0,3.5 3.5,3.5 3.5,0 96.5,0 96.5,3.5 100,3.5 100,81.5 96.5,81.5 96.5,85 3.5,85 3.5,81.5 0,81.5
Copper layers (1*16): Top 0.018mm / dielectric 1.55mm / Bottom 0.018mm
Design rules: minimum track width 0.15mm, minimum drill 0.25mm, track to track 0.15mm, track to pad 0.15mm, pad to pad 0.15mm, via to via 0.15mm, smd to smd 0.15mm, copper to edge 0.45mm, drill to drill 0.3mm, minimum pad ring 0.2mm, minimum via ring 0.2mm, stop-mask expansion 0.1mm, vias tented up to drill 0.4mm, thermal gap 0.2mm
Holes 2 mm at 96.4,57.4 96.4,27.6 3.6,27.6 3.6,57.4

### Footprints (pad centres in the part's own frame; a part is rotated, then mirrored left to right if it is on the bottom)
CHIP_0805 = smd 1.2 x 1.4: 1 -1,0; 2 1,0
MELF = smd 1.5 x 3: A 2.6,0; K -2.6,0
LED3MM = drill 0.8 long: A -1.27,0; K 1.27,0
MINIMELF = smd 1.3 x 2: A 1.9,0; K -1.9,0
CHIP_1812 = smd 1.8 x 3.4: 1 -2.5,0; 2 2.5,0
TME-24V = drill 0.7 pad 1.1 long: 1 -3.81,0; 2 -1.27,0; 3 1.27,0; 4 3.81,0
KZH20P = smd 8 x 8: N 0,0 | drill 2 long: P1 -10.425,0; P2 10.425,0
QFP44_08 = smd 1.5 x 0.5: 1 -5.8,4; 2 -5.8,3.2; 3 -5.8,2.4; 4 -5.8,1.6; 5 -5.8,0.8; 6 -5.8,0; 7 -5.8,-0.8; 8 -5.8,-1.6; 9 -5.8,-2.4; 10 -5.8,-3.2; 11 -5.8,-4; 23 5.8,-4; 24 5.8,-3.2; 25 5.8,-2.4; 26 5.8,-1.6; 27 5.8,-0.8; 28 5.8,0; 29 5.8,0.8; 30 5.8,1.6; 31 5.8,2.4; 32 5.8,3.2; 33 5.8,4 | smd 0.5 x 1.5: 12 -4,-5.8; 13 -3.2,-5.8; 14 -2.4,-5.8; 15 -1.6,-5.8; 16 -0.8,-5.8; 17 0,-5.8; 18 0.8,-5.8; 19 1.6,-5.8; 20 2.4,-5.8; 21 3.2,-5.8; 22 4,-5.8; 34 4,5.8; 35 3.2,5.8; 36 2.4,5.8; 37 1.6,5.8; 38 0.8,5.8; 39 0,5.8; 40 -0.8,5.8; 41 -1.6,5.8; 42 -2.4,5.8; 43 -3.2,5.8; 44 -4,5.8
SOP08_127 = smd 0.7 x 2: 1 -1.905,-3; 2 -0.635,-3; 3 0.635,-3; 4 1.905,-3; 5 1.905,3; 6 0.635,3; 7 -0.635,3; 8 -1.905,3
SOP16_127 = smd 0.7 x 2: 1 -4.445,-3; 2 -3.175,-3; 3 -1.905,-3; 4 -0.635,-3; 5 0.635,-3; 6 1.905,-3; 7 3.175,-3; 8 4.445,-3; 9 4.445,3; 10 3.175,3; 11 1.905,3; 12 0.635,3; 13 -0.635,3; 14 -1.905,3; 15 -3.175,3; 16 -4.445,3
SOP04_254 = smd 0.8 x 1.8: 1 -1.27,-3.25; 2 1.27,-3.25; 3 1.27,3.25; 4 -1.27,3.25
SIP4 = drill 1 long: 1 -7.62,0; 2 -2.54,0; 3 5.08,0; 4 7.62,0
MS1V-T1K = smd 1 x 1.6: 1 -1.3,-1.5; 2 1.3,-1.5 | smd 3 x 2.5: G 0,4.8
TO92 = drill 0.6: 1 1.27,0; 2 -1.27,0
CHIP_1206 = smd 1.3 x 1.8: 1 -1.55,0; 2 1.55,0
DP08 = drill 0.8 long: 13 -8.89,3.81; 14 -8.89,-3.81; 23 -6.35,3.81; 24 -6.35,-3.81; 33 -3.81,3.81; 34 -3.81,-3.81; 43 -1.27,3.81; 44 -1.27,-3.81; 53 1.27,3.81; 54 1.27,-3.81; 63 3.81,3.81; 64 3.81,-3.81; 73 6.35,3.81; 74 6.35,-3.81; 83 8.89,3.81; 84 8.89,-3.81
SOT23 = smd 1 x 1.4: 1 -0.95,-1.1; 2 0.95,-1.1; 3 0,1.1
RIA-73-02 = drill 1.2 long: 1 -2.54,0; 2 2.54,0
ML6L = drill 0.9 octagon: GND 2.54,1.27; MISO -2.54,-1.27; MOSI 0,1.27; RESET 2.54,-1.27; SCK 0,-1.27; VCC -2.54,1.27

### Placement (x,y rotation side)
C101  15.71,29.46 270 top
C102  16.98,54.23 180 top
C103  65.24,41.53 270 top
C104  26.5,29.46 270 top
C201  25.23,47.88 270 top
C202  34.76,38.35 0 top
C203  34.76,57.4 180 top
C204  44.28,47.88 90 top
C205  48.09,47.88 270 top
D101  LL5819  [MELF]  24.6,72.01 0 top
D102  32.22,80.26 90 top
D103  19.52,26.29 0 bottom
D104  19.52,23.75 0 bottom
D201  39.84,63.75 90 top
D202  44.28,63.75 90 top
D301  55.71,51.05 270 top
D302  60.79,51.05 270 top
D303  65.87,51.05 270 top
D304  70.95,51.05 270 top
D305  76.03,51.05 270 top
D306  81.11,51.05 270 top
D307  86.19,51.05 270 top
D308  91.27,51.05 270 top
D401  46.82,33.27 270 top
D402  53.17,33.27 270 top
D403  59.52,33.27 270 top
D404  65.87,33.27 270 top
D405  72.22,33.27 270 top
D406  78.57,33.27 270 top
D407  84.92,33.27 270 top
D408  91.27,33.27 270 top
F101  34.12,66.29 90 top
G101  25.87,64.39 0 top
G102  9.36,70.74 90 top
IC201  34.76,47.88 0 top
IC202  30.31,29.46 0 top
IC203  19.52,29.46 180 top
IC204  16.98,47.24 270 top
IC301  54.44,61.85 180 top
IC302  59.52,61.85 180 top
IC303  64.6,61.85 180 top
IC304  69.68,61.85 180 top
IC305  74.76,61.85 180 top
IC306  79.84,61.85 180 top
IC307  84.92,61.85 180 top
IC308  90,61.85 180 top
IC401  72.22,41.53 0 top
K401  46.19,21.84 90 top
K402  52.54,21.84 90 top
K403  58.89,21.84 90 top
K404  65.24,21.84 90 top
K405  71.59,21.84 90 top
K406  77.94,21.84 90 top
K407  84.29,21.84 90 top
K408  90.64,21.84 90 top
Q201  30.31,21.84 180 top
R101  32.22,77.09 0 top
R102  39.84,56.13 0 bottom
R103  44.28,56.13 0 bottom
R201  22.69,53.59 90 top
R202  39.84,60.58 180 top
R203  44.28,60.58 180 top
R204  41.11,32 90 bottom
R205  41.11,28.19 90 top
R206  5.55,33.27 180 bottom
R207  5.55,51.05 180 bottom
R208  5.55,48.51 180 bottom
R209  5.55,45.97 180 bottom
R210  5.55,43.43 180 bottom
R211  5.55,40.89 180 bottom
R212  5.55,38.35 180 bottom
R213  5.55,35.81 180 bottom
R301  56.98,55.5 90 top
R302  62.06,55.5 90 top
R303  67.14,55.5 90 top
R304  72.22,55.5 90 top
R305  77.3,55.5 90 top
R306  82.38,55.5 90 top
R307  87.46,55.5 90 top
R308  92.54,55.5 90 top
R309  55.71,70.74 90 top
R310  60.79,70.74 90 top
R311  65.87,70.74 90 top
R312  70.95,70.74 90 top
R313  76.03,70.74 90 top
R314  81.11,70.74 90 top
R315  86.19,70.74 90 top
R316  91.27,70.74 90 top
R317  53.17,70.74 270 bottom
R318  58.25,70.74 270 bottom
R319  63.33,70.74 270 bottom
R320  68.41,70.74 270 bottom
R321  73.49,70.74 270 bottom
R322  78.57,70.74 270 bottom
R323  83.65,70.74 270 bottom
R324  88.73,70.74 270 bottom
R401  43.65,33.27 270 top
R402  50,33.27 270 top
R403  56.35,33.27 270 top
R404  62.7,33.27 270 top
R405  69.05,33.27 270 top
R406  75.4,33.27 270 top
R407  81.75,33.27 270 top
R408  88.1,33.27 270 top
S201  5.55,42.16 270 top
T301  54.44,55.5 180 top
T302  59.52,55.5 180 top
T303  64.6,55.5 180 top
T304  69.68,55.5 180 top
T305  74.76,55.5 180 top
T306  79.84,55.5 180 top
T307  84.92,55.5 180 top
T308  90,55.5 180 top
X101  24.6,79.63 180 top
X201  10.63,17.4 90 top
X202  25.87,5.33 0 top
X301  44.92,79.63 180 top
X302  60.16,79.63 180 top
X303  70.32,79.63 180 top
X304  80.48,79.63 180 top
X305  90.64,79.63 180 top
X401  46.19,5.33 0 top
X402  58.89,5.33 0 top
X403  69.05,5.33 0 top
X404  79.21,5.33 0 top
X405  89.37,5.33 0 top

### Tracks (layer width: path | path; a pad name or v marks a point on that pad's centre or on a via)
!R  (via drill 0.4)
  Top 0.305: IC401.10 75.4,45.34 72.86,47.88 52.54,47.88 v50,45.34 | v34.76,50.42 33.96,51.22 IC201.40 | IC204.9 21.42,42.8 v22.06,43.43
  Bottom 0.305: v22.06,43.43 27.77,43.43 v34.76,50.42 37.93,47.24 37.93,45.34 38.57,44.7 49.36,44.7 v50,45.34
+5V  (via drill 0.4)
  Top 0.305: T308.2 90,57.55 v90,58.04 | T307.2 84.92,57.55 v84.92,58.04 | T306.2 79.84,57.55 v79.84,58.04 | T305.2 74.76,57.55 v74.76,58.04 | T304.2 69.68,57.55 v69.68,58.04 | T303.2 64.6,57.55 v64.6,58.04 | T302.2 59.52,57.55 v59.52,58.04 | T301.2 54.44,57.55 v54.44,58.04 | C103.1 63.7,42.53 v63.33,42.16 | C102.1 17.98,55.77 v17.61,56.13 | C201.1 23.69,48.88 v23.33,48.51 | C202.1 33.76,36.81 v34.12,36.45 | C204.1 45.82,46.88 v46.19,47.24 | C203.1 35.76,58.94 v35.39,59.31 | C101.1 14.17,30.46 v13.8,30.1 | R101.2 33.22,74.82 36.66,71.37 36.66,66.33 F101.1 | R201.2 v22.69,56.77
  Top 0.406: v7.45,58.04 1.74,52.32 S201.14 S201.24 S201.34 S201.44 S201.54 S201.64 S201.74 3.01,35.81 6.18,32.64 v6.18,30.1 | v30.95,48.51 v34.76,44.7 | 34.12,64.39 F101.1 v34.12,61.85
  Top 0.508: IC201.17 34.76,39.35 C202.1 | IC201.38 35.56,57.2 C203.1 | IC201.5 25.43,48.68 C201.1 | IC201.27 44.08,47.08 C204.1
  Top 0.61: C103.1 66.87,42.53 67.78,43.43 IC401.16 | IC203.8 21.42,28.83 19.79,30.46 C101.1 | C102.1 17.98,52.59 18.88,51.69 IC204.16
  Bottom 0.406: v90,58.04 v84.92,58.04 v79.84,58.04 v74.76,58.04 v69.68,58.04 v64.6,58.04 v59.52,58.04 v54.44,58.04 53.81,58.67 46.82,58.67 | 23.96,58.04 30.31,58.04 v34.12,61.85 35.39,60.58 v35.39,59.31 | 23.96,58.04 18.25,58.04 | 18.25,58.04 v7.45,58.04 | v17.61,56.13 17.61,57.4 18.25,58.04 | v22.69,56.77 23.96,58.04 | v35.39,59.31 35.39,52.96 v30.95,48.51 v23.33,48.51 | v34.76,44.7 34.12,44.07 v34.12,36.45 35.39,35.18 40.47,35.18 | X201.VCC 6.18,18.03 v6.18,30.1 v13.8,30.1 15.07,30.1 17.61,27.56 D103.A | 46.82,58.67 36.03,58.67 v35.39,59.31 | v63.33,42.16 62.7,42.16 57.62,37.08 42.38,37.08 40.47,35.18 | v46.19,47.24 47.46,48.51 47.46,58.04 46.82,58.67 | R204.2 41.11,34.54 40.47,35.18
ALARM1  (via drill 0.4)
  Top 0.305: IC201.11 28.41,43.33 v28.41,35.18 | v32.85,24.38 32.22,25.02 31.58,25.02 30.95,25.65 IC202.3
  Bottom 0.305: v28.41,35.18 32.85,30.73 v32.85,24.38
ALARM2
  Top 0.305: IC202.7 29.68,38.99 30.76,40.07 IC201.12
BAT  (via drill 0.4)
  Top 0.305: v42.38,51.05 41.6,50.28 IC201.31
  Bottom 0.305: R102.1 41.74,56.13 | 41.74,56.13 R103.2 | v42.38,51.05 42.38,55.5 41.74,56.13
C1  (via drill 0.4)
  Top 0.305: IC401.11 74.13,45.34 72.22,47.24 53.17,47.24 v51.27,45.34 | v34.76,49.15 33.16,50.75 IC201.41 | IC204.7 12.53,44.07 11.9,43.43 11.9,42.16 12.53,41.53 15.71,41.53 v16.34,42.16
  Bottom 0.305: v16.34,42.16 27.77,42.16 v34.76,49.15 37.3,46.61 37.3,44.7 37.93,44.07 50,44.07 v51.27,45.34
C2  (via drill 0.4)
  Top 0.305: IC401.12 72.86,45.34 71.59,46.61 53.81,46.61 v52.54,45.34 | v34.76,47.88 32.36,50.28 IC201.42 32.36,55.36 v30.95,56.77 | IC204.15 21.42,50.42 v22.06,49.78
  Bottom 0.305: v22.06,49.78 22.69,50.42 24.6,50.42 v30.95,56.77 | v34.76,47.88 36.66,45.97 36.66,44.07 37.3,43.43 50.63,43.43 v52.54,45.34
DI  (via drill 0.4)
  Top 0.305: IC204.13 21.42,47.88 v22.06,48.51 | v30.95,55.5 31.58,54.86 31.58,53.7 IC201.43
  Bottom 0.305: v22.06,48.51 23.33,49.78 25.23,49.78 v30.95,55.5
DO  (via drill 0.4)
  Top 0.305: IC401.14 70.32,45.34 69.68,45.97 54.44,45.97 v53.81,45.34 | IC201.44 30.76,50.61 v34.76,46.61
  Bottom 0.305: v34.76,46.61 36.03,45.34 36.03,43.43 36.66,42.8 51.27,42.8 v53.81,45.34
GND  (via drill 0.4)
  Top 0.305: IC308.3 90,59.87 v90,59.94 | IC307.3 84.92,59.87 v84.92,59.94 | IC306.3 79.84,59.87 v79.84,59.94 | IC305.3 74.76,59.87 v74.76,59.94 | IC304.3 69.68,59.87 v69.68,59.94 | IC303.3 64.6,59.87 v64.6,59.94 | IC302.3 59.52,59.87 v59.52,59.94 | IC301.3 54.44,59.87 v54.44,59.94 | IC401.13 71.59,41.16 70.95,40.53 | C103.2 63.7,40.53 v63.33,40.89 | C102.2 15.98,55.77 v16.34,56.13 | C201.2 23.69,46.88 v23.33,47.24 | C202.2 35.76,36.81 v35.39,36.45 | C204.2 45.82,48.88 v46.19,48.51 47.82,46.88 C205.2 | C203.2 33.76,58.94 v34.12,59.31 | C101.2 14.17,28.46 v13.8,28.83 | C104.2 24.96,28.46 v24.6,28.83 | Q201.G v30.31,14.86 | IC204.1 15.34,51.69 15.98,52.32 | IC204.6 15.34,45.34 15.98,45.97 | IC204.14 16.61,49.15 15.98,49.78
  Top 0.406: G102.N v18.25,61.85
  Top 0.508: IC201.18 35.56,38.55 C202.2 | IC201.39 34.76,56.4 C203.2 | IC201.6 26.23,47.88 C201.2 | IC201.28 43.28,47.88 C204.2
  Top 0.61: C103.2 70.95,40.53 75.76,40.53 76.67,39.62 IC401.8 | C101.2 16.71,28.46 17.61,27.56 IC203.5 | C104.2 31.31,28.46 32.22,27.56 IC202.4 | C102.2 15.98,52.32 15.98,49.78 15.98,45.97 15.98,43.7 15.07,42.8 IC204.8
  pour Bottom: 0.47,7.24 0.47,77.72 6.82,84.07 33.49,84.07 36.03,81.53 36.03,75.82 51.27,60.58 96.99,60.58 99.53,58.04 99.53,27.56 96.99,25.02 41.11,25.02 36.03,19.94 36.03,3.43 33.49,0.89 6.82,0.89
GNDIO
  pour Bottom (rank 2): 47.46,82.8 42.38,82.8 41.11,81.53 41.11,78.36 47.46,72.01 90,72.01 91.27,73.28 91.27,74.55 90,75.82 54.44,75.82
IN0  (via drill 0.4)
  Top 0.305: R301.2 54.88,54.4 T301.3 53.17,53.13 v53.17,49.15 | IC201.19 36.36,39.93 37.93,38.35 43.65,38.35 44.92,39.62 48.09,39.62 v48.73,38.99
  Bottom 0.305: v53.17,49.15 55.08,47.24 55.08,45.34 v48.73,38.99
IN1  (via drill 0.4)
  Top 0.305: R302.2 59.96,54.4 T302.3 58.25,53.13 v58.25,49.15 | IC201.20 37.16,40.4 38.57,38.99 43.01,38.99 44.28,40.26 48.73,40.26 v50,38.99
  Bottom 0.305: v50,38.99 58.25,47.24 v58.25,49.15
IN2  (via drill 0.4)
  Top 0.305: R303.2 65.04,54.4 T303.3 63.33,53.13 v63.33,49.15 | IC201.21 37.96,40.87 39.2,39.62 42.38,39.62 43.65,40.89 49.36,40.89 v51.27,38.99
  Bottom 0.305: v63.33,49.15 62.06,47.88 60.16,47.88 v51.27,38.99
IN3  (via drill 0.4)
  Top 0.305: R304.2 70.12,54.4 T304.3 68.41,53.13 v68.41,49.15 | IC201.22 38.76,41.34 39.84,40.26 41.74,40.26 43.01,41.53 50,41.53 v52.54,38.99
  Bottom 0.305: v68.41,49.15 66.51,47.24 60.79,47.24 v52.54,38.99
IN4  (via drill 0.4)
  Top 0.305: R305.2 75.2,54.4 T305.3 73.49,53.13 v73.49,49.15 | IC201.23 41.3,43.88 43.01,42.16 50.63,42.16 v53.81,38.99
  Bottom 0.305: v73.49,49.15 70.95,46.61 61.43,46.61 v53.81,38.99
IN5  (via drill 0.4)
  Top 0.305: R306.2 80.28,54.4 T306.3 78.57,53.13 v78.57,49.15 | IC201.24 41.77,44.68 43.65,42.8 51.27,42.8 v55.08,38.99
  Bottom 0.305: v78.57,49.15 75.4,45.97 62.06,45.97 v55.08,38.99
IN6  (via drill 0.4)
  Top 0.305: R307.2 85.36,54.4 T307.3 83.65,53.13 v83.65,49.15 | IC201.25 42.24,45.48 44.28,43.43 51.9,43.43 v56.35,38.99
  Bottom 0.305: v83.65,49.15 79.84,45.34 62.7,45.34 v56.35,38.99
IN7  (via drill 0.4)
  Top 0.305: R308.2 90.44,54.4 T308.3 88.73,53.13 v88.73,49.15 | IC201.26 42.71,46.28 44.92,44.07 52.54,44.07 v57.62,38.99
  Bottom 0.305: v88.73,49.15 84.29,44.7 63.33,44.7 v57.62,38.99
L
  Top 1.27: K408.2 K407.2 K406.2 K405.2 K404.2 K403.2 K402.2 K401.2 43.65,19.3 41.11,16.76 41.11,7.87 X401.1 X401.2
  Bottom 1.27: X401.2 X401.1 41.11,7.87 41.11,16.76 43.65,19.3 K401.2 K402.2 K403.2 K404.2 K405.2 K406.2 K407.2 K408.2
MISO  (via drill 0.4)
  Top 0.305: IC201.2 27.75,51.08 v24.6,54.23 | v15.71,33.27 11.9,29.46 11.9,23.11 13.8,21.21 13.8,16.76 13.8,16.13 12.53,14.86 X201.MISO
  Bottom 0.305: v24.6,54.23 18.88,54.23 13.8,49.15 13.8,35.18 v15.71,33.27
MOSI  (via drill 0.4)
  Top 0.305: IC201.1 28.22,51.88 v24.6,55.5 | v13.17,34.54 9.99,31.37 9.99,22.48 8.09,20.57 8.09,18.03 8.72,17.4 X201.MOSI
  Bottom 0.305: v24.6,55.5 18.88,55.5 13.17,49.78 v13.17,34.54
N$1
  Top 0.61: R309.2 55.71,77.72 X302.2
N$2
  Top 0.61: R309.1 IC301.1
N$3  (via drill 0.4)
  Top 0.61: v53.17,66.93 IC301.2
  Bottom 0.61: R317.2 v53.17,66.93
N$4
  Top 0.61: R310.2 60.79,77.72 X302.1
N$5
  Top 0.61: IC302.1 R310.1
N$6  (via drill 0.4)
  Top 0.61: v58.25,66.93 IC302.2
  Bottom 0.61: R318.2 v58.25,66.93
N$7
  Top 0.61: R311.2 65.87,77.72 X303.2
N$8
  Top 0.61: R311.1 IC303.1
N$9  (via drill 0.4)
  Top 0.61: v63.33,66.93 IC303.2
  Bottom 0.61: R319.2 v63.33,66.93
N$10
  Top 0.61: R312.2 70.95,77.72 X303.1
N$11
  Top 0.61: R312.1 IC304.1
N$12  (via drill 0.4)
  Top 0.61: v68.41,66.93 IC304.2
  Bottom 0.61: R320.2 v68.41,66.93
N$13
  Top 0.61: R313.2 76.03,77.72 X304.2
N$14
  Top 0.61: R313.1 IC305.1
N$15  (via drill 0.4)
  Top 0.61: v73.49,66.93 IC305.2
  Bottom 0.61: R321.2 v73.49,66.93
N$16
  Top 0.61: R314.2 81.11,77.72 X304.1
N$17
  Bottom 0.305: K401.3 47.46,26.92 48.73,28.19 48.73,30.1 D401.K
N$18
  Bottom 0.305: K402.3 53.81,26.92 55.08,28.19 55.08,30.1 D402.K
N$19
  Bottom 0.61: X101.2 G101.1
N$20  (via drill 0.4)
  Top 0.305: X202.1 23.33,10.41 18.88,14.86 IC203.6 18.88,28.19 v18.25,28.83
  Bottom 0.305: v18.25,28.83 15.71,31.37 3.64,31.37 S201.84
N$21  (via drill 0.4)
  Top 0.305: v37.3,57.4 37.3,59.31 36.29,60.31 G102.P1
  Top 0.406: G102.P1 9.36,56.77 7.45,54.86 7.45,28.83 v8.72,27.56
  Bottom 0.305: v37.3,57.4 38.57,56.13 R102.2
  Bottom 0.406: v8.72,27.56 12.53,23.75 D104.A
N$22  (via drill 0.4)
  Top 0.305: X202.2 28.41,7.24 20.15,15.49 IC203.7 20.15,28.19 v19.52,28.83
  Bottom 0.305: v19.52,28.83 16.34,32 5.82,32 R206.1
N$23
  Top 0.61: D101.K 22,66.99 G101.2
N$24
  Top 0.61: D101.A 27.14,72.07 X101.1
N$25
  Top 0.305: IC201.29 42.54,48.68 43.01,49.15 43.01,49.78 43.65,50.42 46.55,50.42 C205.1
N$26
  Top 0.305: IC204.2 9.99,50.42 S201.13
  Bottom 0.305: R207.2 S201.13
N$27
  Top 0.305: IC204.3 9.99,49.15 S201.23
  Bottom 0.305: R208.2 S201.23
N$28
  Top 0.305: IC204.4 11.26,47.88 S201.33
  Bottom 0.305: R209.2 S201.33
N$29
  Top 0.305: IC204.5 12.53,46.61 S201.43
  Bottom 0.305: R210.2 S201.43
N$30
  Top 0.305: S201.53 16.34,40.89 17.61,42.16 17.61,43.43 18.25,44.07 IC204.10
  Bottom 0.305: R211.2 S201.53
N$31
  Top 0.305: IC204.11 22.69,45.34 23.33,44.7 23.33,40.89 22.69,40.26 11.26,40.26 S201.63
  Bottom 0.305: R212.2 S201.63
N$32
  Top 0.305: IC204.12 22.69,46.61 23.96,45.34 23.96,40.26 23.33,39.62 13.17,39.62 S201.73
  Bottom 0.305: R213.2 S201.73
N$33
  Bottom 0.305: R206.2 S201.83
N$34
  Top 0.305: R304.1 70.95,53.23 D304.A
N$35
  Top 0.61: R314.1 IC306.1
N$36
  Top 0.305: R303.1 65.87,53.23 D303.A
N$37  (via drill 0.4)
  Top 0.61: v78.57,66.93 IC306.2
  Bottom 0.61: R322.2 v78.57,66.93
N$38
  Top 0.305: R302.1 60.79,53.23 D302.A
N$39
  Top 0.61: R315.1 IC307.1
N$40
  Top 0.305: R301.1 55.71,53.23 D301.A
N$41
  Top 0.61: G101.4 29.68,66.93 31.58,68.83 34.08,68.83 F101.2
N$42  (via drill 0.4)
  Top 0.305: IC201.4 26.81,49.48 v24.6,51.69 23.6,51.69 R201.1 | v15.71,35.81 10.63,30.73 10.63,21.84 11.9,20.57 X201.RESET
  Bottom 0.305: v24.6,51.69 18.88,51.69 15.07,47.88 15.07,36.45 v15.71,35.81
N$43
  Bottom 0.305: K403.3 60.16,26.92 61.43,28.19 61.43,30.1 D403.K
N$44
  Top 0.305: R101.1 31.22,77.99 D102.A
N$45
  Bottom 0.305: K404.3 66.51,26.92 67.78,28.19 67.78,30.1 D404.K
N$46
  Bottom 0.305: K405.3 72.86,26.92 74.13,28.19 74.13,30.1 D405.K
N$47
  Bottom 0.305: K406.3 79.21,26.92 80.48,28.19 80.48,30.1 D406.K
N$48
  Bottom 0.305: K407.3 85.56,26.92 86.83,28.19 86.83,30.1 D407.K
N$49
  Bottom 0.305: K408.3 91.91,26.92 93.18,28.19 93.18,30.1 D408.K
N$50  (via drill 0.4)
  Top 0.61: v83.65,66.93 IC307.2
  Bottom 0.61: R323.2 v83.65,66.93
N$51  (via drill 0.4)
  Top 0.305: R401.1 47.09,37.72 53.81,37.72 64.6,37.72 v65.87,38.99 | v69.05,42.16 IC401.15
  Bottom 0.305: v65.87,38.99 v69.05,42.16
N$52
  Top 0.305: IC304.4 70.95,56.92 T304.1
N$53
  Top 0.305: IC401.1 67.78,37.72 67.14,37.08 52.81,37.08 R402.1
N$54
  Top 0.305: IC401.2 69.05,37.08 68.41,36.45 58.52,36.45 R403.1
N$55
  Top 0.305: R305.1 76.03,53.23 D305.A
N$56
  Top 0.305: IC401.3 70.32,37.08 69.05,35.81 64.24,35.81 R404.1
N$57
  Top 0.61: R315.2 86.19,77.72 X305.2
N$58
  Top 0.305: IC401.4 71.59,36.81 R405.1
N$59
  Top 0.305: IC401.5 72.86,36.81 R406.1
N$60
  Top 0.305: IC401.6 74.13,37.08 75.4,35.81 80.21,35.81 R407.1
N$61  (via drill 0.4)
  Top 0.305: IC201.30 38.9,49.48 38.57,49.15 38.57,44.07 39.84,42.8 v39.84,41.53 | v39.84,37.08 41.11,35.81 R205.1
  Bottom 0.305: v39.84,41.53 v39.84,37.08 | R204.1 R205.1
N$62
  Top 0.305: D201.A 40.84,61.48 R202.1
N$63
  Top 0.305: D202.A 45.28,61.48 R203.1
N$64  (via drill 0.4)
  Top 0.305: C104.1 24.96,30.46 v24.6,30.1
  Top 0.61: C104.1 27.5,30.46 28.41,31.37 IC202.8
  Bottom 0.406: D104.K D103.K 21.42,28.82 22.69,30.1 v24.6,30.1
N$65
  Top 0.305: R306.1 81.11,53.23 D306.A
N$66
  Top 0.305: IC401.7 75.4,37.08 76.03,36.45 85.92,36.45 R408.1
N$67
  Top 0.61: R316.2 91.27,77.72 X305.1
N$68
  Top 1.27: K401.1 55.08,5.33 X402.1
  Bottom 1.27: K401.1 55.08,5.33 X402.1
N$69
  Top 0.305: R307.1 86.19,53.23 D307.A
N$70
  Top 0.305: IC303.4 65.87,56.92 T303.1
N$71
  Top 0.61: R316.1 IC308.1
N$72
  Top 1.27: K402.1 X402.2
  Bottom 1.27: K402.1 X402.2
N$73
  Top 0.305: IC302.4 60.79,56.92 T302.1
N$74
  Top 1.27: K403.1 66.51,6.6 X403.1
  Bottom 1.27: K403.1 66.51,6.6 X403.1
N$75
  Top 0.305: IC301.4 55.71,56.92 T301.1
N$76
  Top 1.27: K404.1 71.59,7.87 X403.2
  Bottom 1.27: K404.1 71.59,7.87 X403.2
N$77
  Top 0.305: D308.A 91.27,53.23 R308.1
N$78
  Top 1.27: K405.1 76.67,9.14 X404.1
  Bottom 1.27: K405.1 76.67,9.14 X404.1
N$79  (via drill 0.4)
  Top 0.61: v88.73,66.93 IC308.2
  Bottom 0.61: R324.2 v88.73,66.93
N$80
  Top 0.305: IC305.4 76.03,56.92 T305.1
N$81
  Top 0.305: IC306.4 81.11,56.92 T306.1
N$82
  Top 1.27: K406.1 81.75,10.41 X404.2
  Bottom 1.27: K406.1 81.75,10.41 X404.2
N$83
  Top 0.305: IC307.4 86.19,56.92 T307.1
N$84
  Top 1.27: K407.1 86.83,11.68 X405.1
  Bottom 1.27: K407.1 86.83,11.68 X405.1
N$85
  Top 0.305: IC308.4 91.27,56.92 T308.1
N$89
  Top 1.27: K408.1 91.91,12.95 X405.2
  Bottom 1.27: K408.1 91.91,12.95 X405.2
N$90
  Top 0.305: IC201.37 36.36,55.19 38.57,57.4 38.57,60.31 R202.2
N$92
  Top 0.305: IC201.36 37.16,54.72 43.01,60.58 R203.2
N$103
  Top 0.305: R401.2 43.92,32.27 46.19,34.54 D401.A
N$104
  Top 0.305: R402.2 50.27,32.27 52.54,34.54 D402.A
N$105
  Top 0.305: R403.2 56.62,32.27 58.89,34.54 D403.A
N$106
  Top 0.305: R404.2 62.97,32.27 65.24,34.54 D404.A
N$107
  Top 0.305: R405.2 69.32,32.27 71.59,34.54 D405.A
N$108
  Top 0.305: R406.2 75.67,32.27 77.94,34.54 D406.A
N$109
  Top 0.305: R407.2 82.02,32.27 84.29,34.54 D407.A
N$110
  Top 0.305: R408.2 88.37,32.27 90.64,34.54 D408.A
N$126
  Top 0.305: IC202.1 28.41,23.95 Q201.2
N$127
  Top 0.305: IC202.2 29.68,25.28 Q201.1
RE  (via drill 0.4)
  Top 0.305: IC201.14 32.36,43.57 v33.49,44.7 | v23.96,35.81 21.42,35.81 20.15,34.54 IC203.2
  Bottom 0.305: v33.49,44.7 24.6,35.81 v23.96,35.81
RXD
  Top 0.305: IC203.1 21.42,33.91 22.06,34.54 24.6,34.54 25.23,35.18 25.23,44.7 26.01,45.48 IC201.9
SCK  (via drill 0.4)
  Top 0.305: IC201.3 27.28,50.28 v24.6,52.96 | v15.71,34.54 11.26,30.1 11.26,22.48 13.17,20.57 13.17,18.67 13.17,18.03 12.53,17.4 X201.SCK
  Bottom 0.305: v24.6,52.96 18.88,52.96 14.44,48.51 14.44,35.81 v15.71,34.54
SCL
  Top 0.305: IC201.15 33.16,41.2 30.95,38.99 IC202.6
SDA
  Top 0.305: IC201.16 33.96,40.73 32.22,38.99 IC202.5
TE  (via drill 0.4)
  Top 0.305: IC201.13 31.56,44.04 v32.22,44.7 | v23.96,37.08 21.42,37.08 18.88,34.54 IC203.3
  Bottom 0.305: v32.22,44.7 24.6,37.08 v23.96,37.08
TXD  (via drill 0.4)
  Top 0.305: IC203.4 17.61,34.54 21.42,38.35 v23.96,38.35 | IC201.10 27.11,44.68 26.5,44.07 v26.5,40.89
  Bottom 0.305: v26.5,40.89 v23.96,38.35

### Text on the board
tNames: Rev 1.0 | Homelogic | Dig AC230